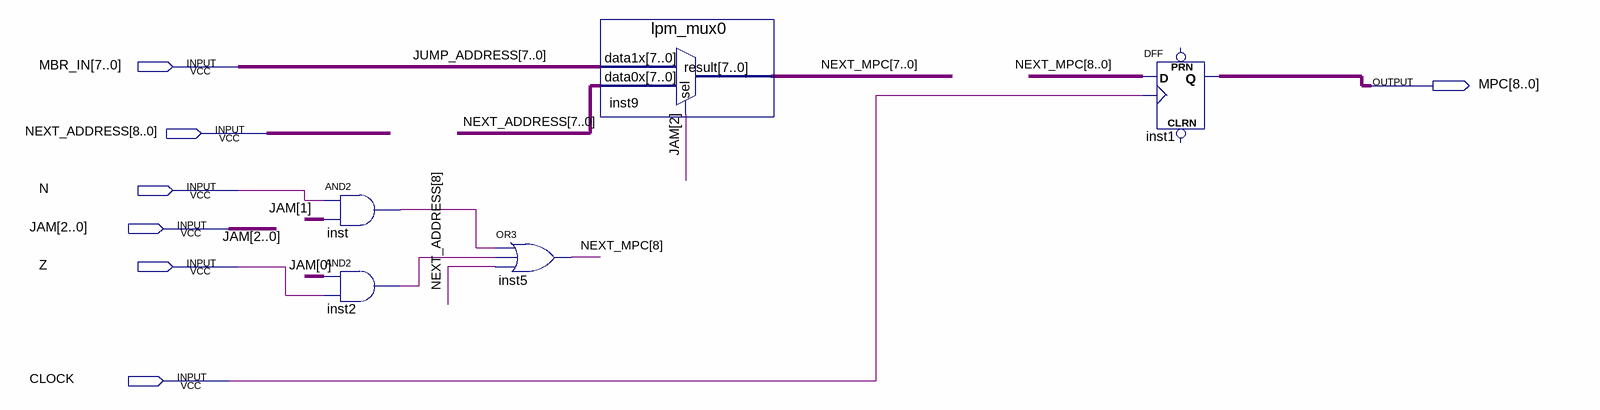
[diagram p0: schematic sheet]
// Quartus schematic MPC_generator.bdf as structural Verilog: 5 symbols, 7 pins
module MPC_generator (
  input  [7:0] MBR_IN,
  input  [8:0] NEXT_ADDRESS,
  input  N,
  input  [2:0] JAM,
  input  Z,
  input  CLOCK,
  output [8:0] MPC
);

  wire inst2_out, inst_out;
  wire [8:0] NEXT_MPC;

  and inst (inst_out, N, JAM[1]);
  and inst2 (inst2_out, JAM[0], Z);
  or inst5 (NEXT_MPC[8], inst_out, inst2_out, NEXT_ADDRESS[8]);
  lpm_mux0 inst9 (.data1x(MBR_IN), .data0x(NEXT_ADDRESS[7:0]), .sel(JAM[2]), .result(NEXT_MPC[7:0]));
  DFF inst1[8:0] (.CLK(CLOCK), .D(NEXT_MPC), .Q(MPC));  // open: CLRN, PRN

  // Other names for the same wires on the sheet: JUMP_ADDRESS[7:0] = MBR_IN
endmodule
